# Altium schematic sheet EPROM_Programmer.SchDoc: EPROM MANUAL PROGRAMMER
size A4; Author: L.JAOUANNE; Revision: v1.0; SheetNumber: 1; SheetTotal: 3
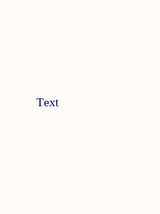
[diagram p0: EPROM_Programmer.SchDoc, left]
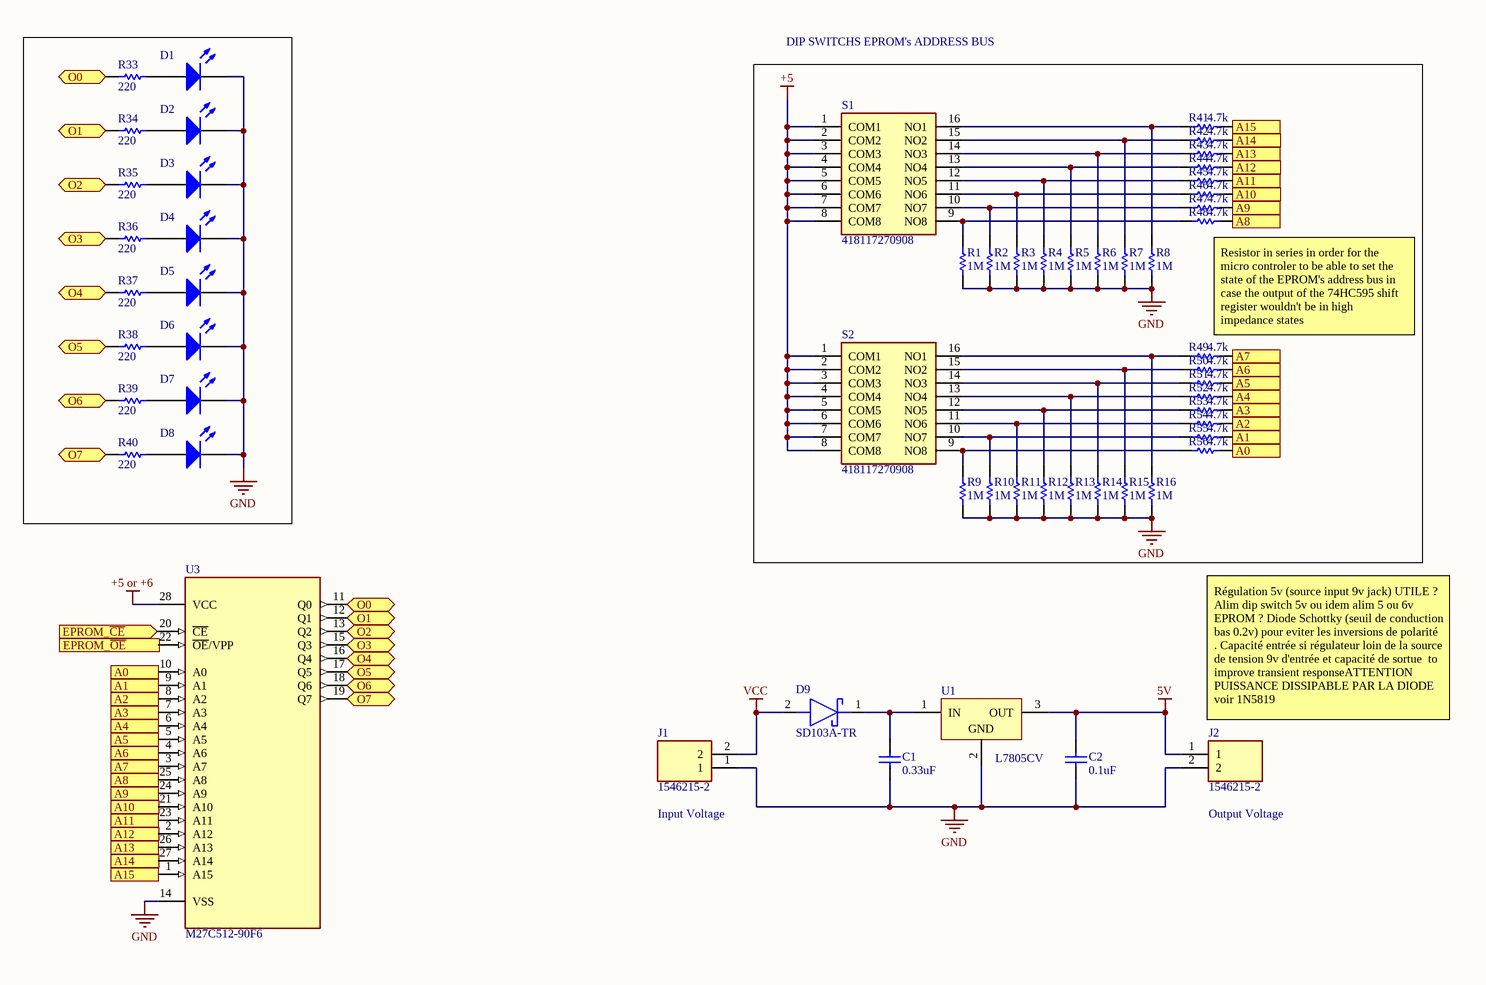
[diagram p1: EPROM_Programmer.SchDoc, right]

## Parts
C1  0.33uF  [C0603]
C2  0.1uF  [C0603]
D1  LED_SMD  [0603_LED]  (value not drawn)
D2  LED_SMD  [0603_LED]  (value not drawn)
D3  LED_SMD  [0603_LED]  (value not drawn)
D4  LED_SMD  [0603_LED]  (value not drawn)
D5  LED_SMD  [0603_LED]  (value not drawn)
D6  LED_SMD  [0603_LED]  (value not drawn)
D7  LED_SMD  [0603_LED]  (value not drawn)
D8  LED_SMD  [0603_LED]  (value not drawn)
D9  SD103A-TR  [DIOAD950W60L350D150]
J1  1546215-2  [15462152]
J2  1546215-2  [15462152]
R1  value 1M  [R0603]  (hidden comment: Res1)
R2  value 1M  [R0603]  (hidden comment: Res1)
R3  value 1M  [R0603]  (hidden comment: Res1)
R4  value 1M  [R0603]  (hidden comment: Res1)
R5  value 1M  [R0603]  (hidden comment: Res1)
R6  value 1M  [R0603]  (hidden comment: Res1)
R7  value 1M  [R0603]  (hidden comment: Res1)
R8  value 1M  [R0603]  (hidden comment: Res1)
R9  value 1M  [R0603]  (hidden comment: Res1)
R10  value 1M  [R0603]  (hidden comment: Res1)
R11  value 1M  [R0603]  (hidden comment: Res1)
R12  value 1M  [R0603]  (hidden comment: Res1)
R13  value 1M  [R0603]  (hidden comment: Res1)
R14  value 1M  [R0603]  (hidden comment: Res1)
R15  value 1M  [R0603]  (hidden comment: Res1)
R16  value 1M  [R0603]  (hidden comment: Res1)
R33  value 220  [R0603]  (hidden comment: Res1)
R34  value 220  [R0603]  (hidden comment: Res1)
R35  value 220  [R0603]  (hidden comment: Res1)
R36  value 220  [R0603]  (hidden comment: Res1)
R37  value 220  [R0603]  (hidden comment: Res1)
R38  value 220  [R0603]  (hidden comment: Res1)
R39  value 220  [R0603]  (hidden comment: Res1)
R40  value 220  [R0603]  (hidden comment: Res1)
R41  value 4.7k  [R0603]  (hidden comment: Res1)
R42  value 4.7k  [R0603]  (hidden comment: Res1)
R43  value 4.7k  [R0603]  (hidden comment: Res1)
R44  value 4.7k  [R0603]  (hidden comment: Res1)
R45  value 4.7k  [R0603]  (hidden comment: Res1)
R46  value 4.7k  [R0603]  (hidden comment: Res1)
R47  value 4.7k  [R0603]  (hidden comment: Res1)
R48  value 4.7k  [R0603]  (hidden comment: Res1)
R49  value 4.7k  [R0603]  (hidden comment: Res1)
R50  value 4.7k  [R0603]  (hidden comment: Res1)
R51  value 4.7k  [R0603]  (hidden comment: Res1)
R52  value 4.7k  [R0603]  (hidden comment: Res1)
R53  value 4.7k  [R0603]  (hidden comment: Res1)
R54  value 4.7k  [R0603]  (hidden comment: Res1)
R55  value 4.7k  [R0603]  (hidden comment: Res1)
R56  value 4.7k  [R0603]  (hidden comment: Res1)
S1  418117270908  [DIPS762W60P254L2132H695Q16N]
S2  418117270908  [DIPS762W60P254L2132H695Q16N]
U1  L7805CV  [TO254P1054X470X1955-3]
U3  M27C512-90F6  [DIP254P1524X572-28]

## Blocks framed on the sheet
DIP SWITCHS EPROM's ADDRESS BUS: R1-R16 R41-R56 S1 S2

## Ports
A0 (in, see EPROM_Programmer[4B], EPROM_Programmer_3[1C]), A0 (out, see EPROM_Programmer[1C], EPROM_Programmer_3[1C]), A1 (in, see EPROM_Programmer[4B], EPROM_Programmer_3[1C]), A1 (out, see EPROM_Programmer[1C], EPROM_Programmer_3[1C]), A2 (in, see EPROM_Programmer[4B], EPROM_Programmer_3[1C]), A2 (out, see EPROM_Programmer[1C], EPROM_Programmer_3[1C]), A3 (in, see EPROM_Programmer[4B], EPROM_Programmer_3[1C]), A3 (out, see EPROM_Programmer[1C], EPROM_Programmer_3[1C]), A4 (in, see EPROM_Programmer[4B], EPROM_Programmer_3[1C]), A4 (out, see EPROM_Programmer[1C], EPROM_Programmer_3[1C]), A5 (in, see EPROM_Programmer[4B], EPROM_Programmer_3[1C]), A5 (out, see EPROM_Programmer[1C], EPROM_Programmer_3[1C]), A6 (in, see EPROM_Programmer[4B], EPROM_Programmer_3[1C]), A6 (out, see EPROM_Programmer[1D], EPROM_Programmer_3[1C]), A7 (in, see EPROM_Programmer[4B], EPROM_Programmer_3[1C]), A7 (out, see EPROM_Programmer[1D], EPROM_Programmer_3[1C]), A8 (in, see EPROM_Programmer[4A], EPROM_Programmer_3[2D]), A8 (out, see EPROM_Programmer[1D], EPROM_Programmer_3[2D]), A9 (in, see EPROM_Programmer[4A], EPROM_Programmer_3[1D]), A9 (out, see EPROM_Programmer[1D], EPROM_Programmer_3[1D]), A10 (in, see EPROM_Programmer[4A], EPROM_Programmer_3[1D]), A10 (out, see EPROM_Programmer[1D], EPROM_Programmer_3[1D]), A11 (in, see EPROM_Programmer[4A], EPROM_Programmer_3[1D]), A11 (out, see EPROM_Programmer[1D], EPROM_Programmer_3[1D]), A12 (in, see EPROM_Programmer[4A], EPROM_Programmer_3[1D]), A12 (out, see EPROM_Programmer[1D], EPROM_Programmer_3[1D]), A13 (in, see EPROM_Programmer[4A], EPROM_Programmer_3[1D]), A13 (out, see EPROM_Programmer[1D], EPROM_Programmer_3[1D]), A14 (in, see EPROM_Programmer[4A], EPROM_Programmer_3[1D]), A14 (out, see EPROM_Programmer[1D], EPROM_Programmer_3[1D]), A15 (in, see EPROM_Programmer[4A], EPROM_Programmer_3[1D]), A15 (out, see EPROM_Programmer[1D], EPROM_Programmer_3[1D]), EPROM_~{CE} (in, see EPROM_Programmer_2[4B]), EPROM_~{OE} (in, see EPROM_Programmer_3[4A]), O0 (bidir, see EPROM_Programmer[1A]), O0 (bidir, see EPROM_Programmer[2C]), O1 (bidir, see EPROM_Programmer[1A]), O1 (bidir, see EPROM_Programmer[2C]), O2 (bidir, see EPROM_Programmer[1A]), O2 (bidir, see EPROM_Programmer[2C]), O3 (bidir, see EPROM_Programmer[1A]), O3 (bidir, see EPROM_Programmer[2C]), O4 (bidir, see EPROM_Programmer[1B]), O4 (bidir, see EPROM_Programmer[2C]), O5 (bidir, see EPROM_Programmer[1B]), O5 (bidir, see EPROM_Programmer[2C]), O6 (bidir, see EPROM_Programmer[1B]), O6 (bidir, see EPROM_Programmer[2C]), O7 (bidir, see EPROM_Programmer[1B]), O7 (bidir, see EPROM_Programmer[2C])

## Nets
5V: C2.1 J2.1 U1.3(OUT)
+5: S1.1(COM1) S1.2(COM2) S1.3(COM3) S1.4(COM4) S1.5(COM5) S1.6(COM6) S1.7(COM7) S1.8(COM8) S2.1(COM1) S2.2(COM2) S2.3(COM3) S2.4(COM4) S2.5(COM5) S2.6(COM6) S2.7(COM7) S2.8(COM8)
+5 or +6: U3.28(VCC)
GND: C1.2 C2.2 D1.2(K) D2.2(K) D3.2(K) D4.2(K) D5.2(K) D6.2(K) D7.2(K) D8.2(K) J1.1 J2.2 R1.2 R2.2 R3.2 R4.2 R5.2 R6.2 R7.2 R8.2 R9.2 R10.2 R11.2 R12.2 R13.2 R14.2 R15.2 R16.2 U1.2(GND) U3.14(VSS)
VCC: D9.2(A) J1.2
A0: R56.2 U3.10(A0) ; port A0
A1: R55.2 U3.9(A1) ; port A1
A2: R54.2 U3.8(A2) ; port A2
A3: R53.2 U3.7(A3) ; port A3
A4: R52.2 U3.6(A4) ; port A4
A5: R51.2 U3.5(A5) ; port A5
A6: R50.2 U3.4(A6) ; port A6
A7: R49.2 U3.3(A7) ; port A7
A8: R48.2 U3.25(A8) ; port A8
A9: R47.2 U3.24(A9) ; port A9
A10: R46.2 U3.21(A10) ; port A10
A11: R45.2 U3.23(A11) ; port A11
A12: R44.2 U3.2(A12) ; port A12
A13: R43.2 U3.26(A13) ; port A13
A14: R42.2 U3.27(A14) ; port A14
A15: R41.2 U3.1(A15) ; port A15
EPROM_~{CE}: U3.20(~{CE}) ; port EPROM_~{CE}
O0: R33.2 U3.11(Q0) ; port O0
O1: R34.2 U3.12(Q1) ; port O1
O2: R35.2 U3.13(Q2) ; port O2
O3: R36.2 U3.15(Q3) ; port O3
O4: R37.2 U3.16(Q4) ; port O4
O5: R38.2 U3.17(Q5) ; port O5
O6: R39.2 U3.18(Q6) ; port O6
O7: R40.2 U3.19(Q7) ; port O7
NetC1_1: C1.1 D9.1(K) U1.1(IN)
NetD1_1: D1.1(A) R33.1
NetD2_1: D2.1(A) R34.1
NetD3_1: D3.1(A) R35.1
NetD4_1: D4.1(A) R36.1
NetD5_1: D5.1(A) R37.1
NetD6_1: D6.1(A) R38.1
NetD7_1: D7.1(A) R39.1
NetD8_1: D8.1(A) R40.1
NetR1_1: R1.1 R48.1 S1.9(NO8)
NetR2_1: R2.1 R47.1 S1.10(NO7)
NetR3_1: R3.1 R46.1 S1.11(NO6)
NetR4_1: R4.1 R45.1 S1.12(NO5)
NetR5_1: R5.1 R44.1 S1.13(NO4)
NetR6_1: R6.1 R43.1 S1.14(NO3)
NetR7_1: R7.1 R42.1 S1.15(NO2)
NetR8_1: R8.1 R41.1 S1.16(NO1)
NetR9_1: R9.1 R56.1 S2.9(NO8)
NetR10_1: R10.1 R55.1 S2.10(NO7)
NetR11_1: R11.1 R54.1 S2.11(NO6)
NetR12_1: R12.1 R53.1 S2.12(NO5)
NetR13_1: R13.1 R52.1 S2.13(NO4)
NetR14_1: R14.1 R51.1 S2.14(NO3)
NetR15_1: R15.1 R50.1 S2.15(NO2)
NetR16_1: R16.1 R49.1 S2.16(NO1)

Not connected (* = marked no-connect by the designer): U3 22(~{OE}/VPP)

## Notes on the sheet
- Text
- Resistor in series in order for the micro controler to be able to set the state of the EPROM's address bus in case the output of the 74HC595 shift register wouldn't be in high impedance states
- (near J2) Régulation 5v (source input 9v jack) UTILE ? Alim dip switch 5v ou idem alim 5 ou 6v EPROM ? Diode Schottky (seuil de conduction bas 0.2v) pour eviter les inversions de polarité . Capacité entrée si régulateur loin de la source de tension 9v d'entrée et capacité de sortue  to improve transient responseATTENTION PUISSANCE DISSIPABLE PAR LA DIODE voir 1N5819
- (near J1) Input Voltage
- (near J2) Output Voltage

## Library data of the parts
C1 C2 = Cap: Capacitor; Value: 100pF; PackageReference: RAD-0.3; PackageDescription: Radial Cap, Thru-Hole; 2 Leads; 0.3 in Pin Spacing
D1-D8 = LED_SMD: LED RED CLEAR 0603 SMD; Manufacturer Part Number: LTST-C191KRKT; PackageReference: 0603 (1608 Metric); PackageDescription: 1.60mm L x 0.80mm W; Digikey Part Number: 160-1447-1-ND; Value: RED
D9 = SD103A-TR: Schottky Diode; Manufacturer_Name: Vishay; Datasheet Link: https://componentsearchengine.com/Datasheets/5/SD103A-TR.pdf; Manufacturer_Part_Number: SD103A-TR; Mouser Part Number: 625-SD103A; Mouser Price/Stock: https://www.mouser.co.uk/ProductDetail/Vishay-Semiconductors/SD103A-TR?qs=RwahMLkpD2urFD%2FzZdGOBw%3D%3D; Arrow Part Number: SD103A-TR; Arrow Price/Stock: https://www.arrow.com/en/products/sd103a-tr/vishay?region=nac
J1 J2 = 1546215-2: Connector; Manufacturer_Name: TE Connectivity; Datasheet Link: https://www.te.com/commerce/DocumentDelivery/DDEController?Action=srchrtrv&DocNm=1-1773458-1_EURO_STYLE_QRG&DocType=Data%20Sheet&DocLang=English&PartCntxt=1546215-2&DocFormat=pdf; Height: 10.3mm; Manufacturer_Part_Number: 1546215-2; Mouser Part Number: 571-1546215-2; Mouser Price/Stock: https://www.mouser.co.uk/ProductDetail/TE-Connectivity/1546215-2?qs=Lxq28tKK6BPmJFoAOY7Ljw%3D%3D; Arrow Part Number: 1546215-2; Arrow Price/Stock: https://www.arrow.com/en/products/1546215-2/te-connectivity?region=nac
R1-R16 R33-R56 = Res1: Resistor; PackageReference: AXIAL-0.3; PackageDescription: Axial Device, Thru-Hole; 2 Leads; 0.3 in Pin Spacing
S1 S2 = 418117270908: Switch; Manufacturer_Name: Wurth Elektronik; Datasheet Link: https://www.we-online.com/catalog/datasheet/418117270908.pdf; Height: 6.95mm; Manufacturer_Part_Number: 418117270908; Mouser Part Number: 710-418117270908; Mouser Price/Stock: https://www.mouser.co.uk/ProductDetail/Wurth-Elektronik/418117270908?qs=wr8lucFkNMXJyYOZ9v4znw%3D%3D
U1 = CMP-0244-00483-1: Positive Voltage Regulator, 5V, 3-Pin TO-220; PackageDescription: TO, Thru-Hole, Vertical, Heatsink Mounted; 3 In-Line Leads; Pitch 2.54 mm; ComponentLink2Description: Datasheet; PackageReference: TO220; ComponentLink3URL: http://www.st.com/internet/com/TECHNICAL_RESOURCES/TECHNICAL_LITERATURE/PACKAGE_INFORMATION/CD00004649.pdf; DatasheetVersion: 16/11/2011; ComponentLink1Description: Manufacturer URL; ComponentLink1URL: http://www.st.com; PackageVersion: ver3.0; ComponentLink3Description: Package Specification; ComponentLink2URL: http://www.st.com/internet/com/TECHNICAL_RESOURCES/TECHNICAL_LITERATURE/DATASHEET/CD00000444.pdf
U3 = M27C512-90F6: EPROM - UV Memory IC 512Kb (64K x 8) Parallel 90 ns 28-CDIP Frit Seal with Window; MF: STMicroelectronics; SnapEDA_Link: https://www.snapeda.com/parts/M27C512-90F6/STMicroelectronics/view-part/?ref=snap; Package: CDIP-28 STMicroelectronics; Value: *; MP: M27C512-90F6; Check_prices: https://www.snapeda.com/parts/M27C512-90F6/STMicroelectronics/view-part/?ref=eda